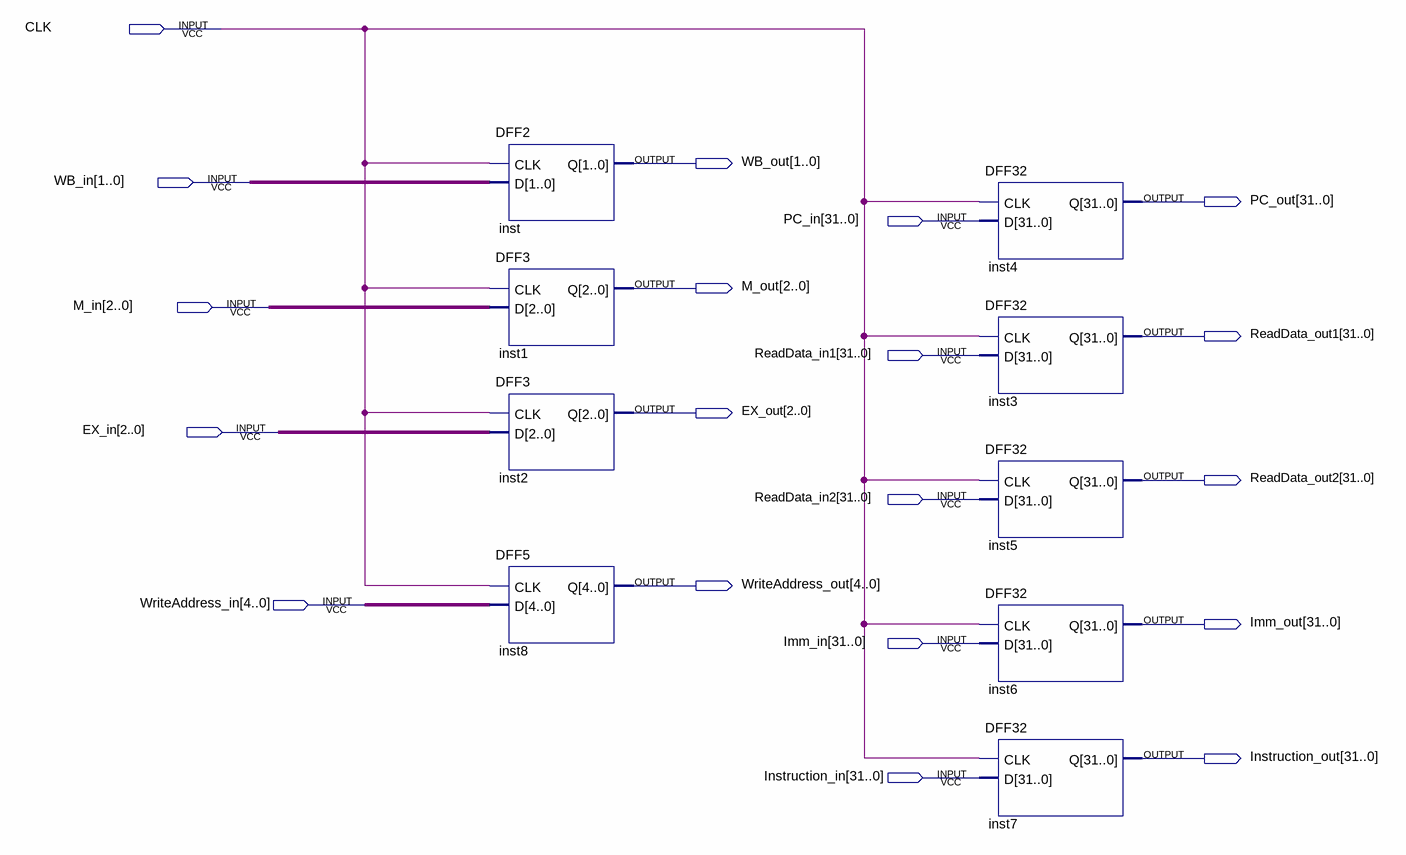
[diagram p0: schematic sheet]
// Quartus schematic ID_EXE.bdf as structural Verilog: 9 symbols, 19 pins
module ID_EXE (
  input  CLK,
  input  [1:0] WB_in,
  input  [31:0] PC_in,
  input  [2:0] M_in,
  input  [31:0] ReadData_in1,
  input  [2:0] EX_in,
  input  [31:0] ReadData_in2,
  input  [4:0] WriteAddress_in,
  input  [31:0] Imm_in,
  input  [31:0] Instruction_in,
  output [1:0] WB_out,
  output [31:0] PC_out,
  output [2:0] M_out,
  output [31:0] ReadData_out1,
  output [2:0] EX_out,
  output [31:0] ReadData_out2,
  output [4:0] WriteAddress_out,
  output [31:0] Imm_out,
  output [31:0] Instruction_out
);

  DFF2 inst (.CLK(CLK), .D(WB_in), .Q(WB_out));
  DFF3 inst1 (.CLK(CLK), .D(M_in), .Q(M_out));
  DFF3 inst2 (.CLK(CLK), .D(EX_in), .Q(EX_out));
  DFF5 inst8 (.CLK(CLK), .D(WriteAddress_in), .Q(WriteAddress_out));
  DFF32 inst4 (.CLK(CLK), .D(PC_in), .Q(PC_out));
  DFF32 inst3 (.CLK(CLK), .D(ReadData_in1), .Q(ReadData_out1));
  DFF32 inst5 (.CLK(CLK), .D(ReadData_in2), .Q(ReadData_out2));
  DFF32 inst6 (.CLK(CLK), .D(Imm_in), .Q(Imm_out));
  DFF32 inst7 (.CLK(CLK), .D(Instruction_in), .Q(Instruction_out));
endmodule
